# EAGLE design moire_v1.4-bwip (EAGLE 9.2.0)

## Sheet 1 of 2
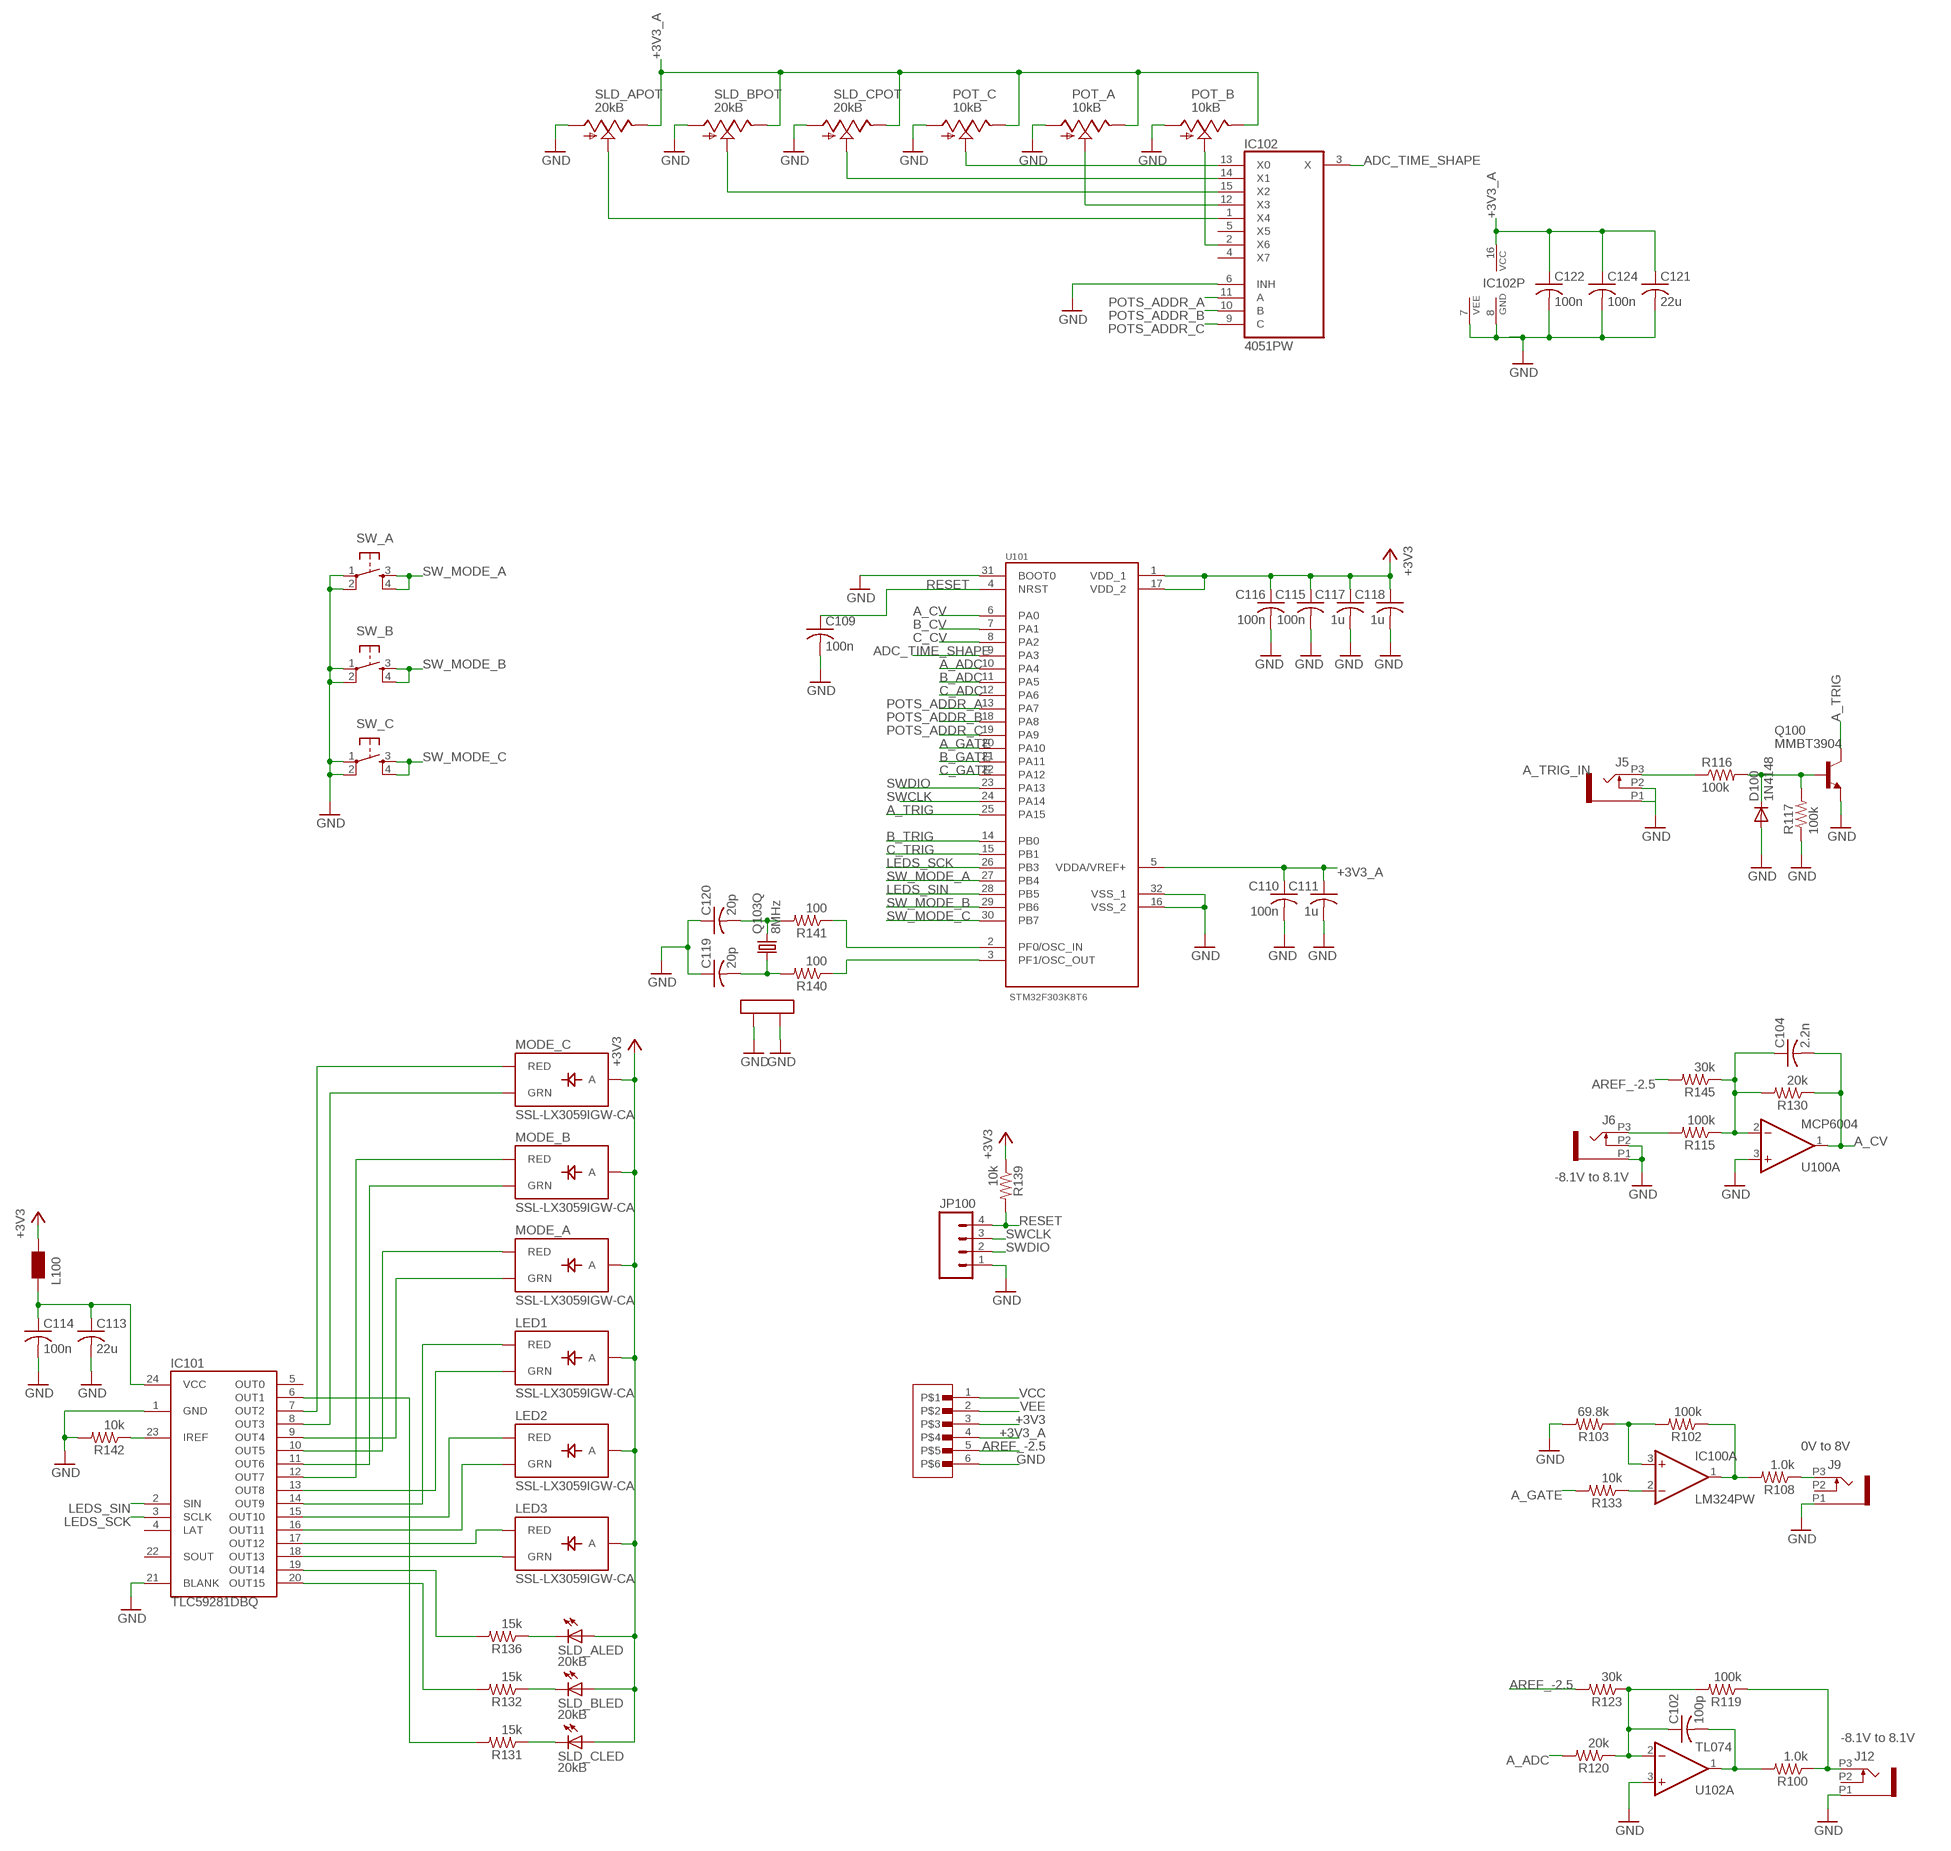
[diagram p0: schematic, sheet 1, part 1 of 2]
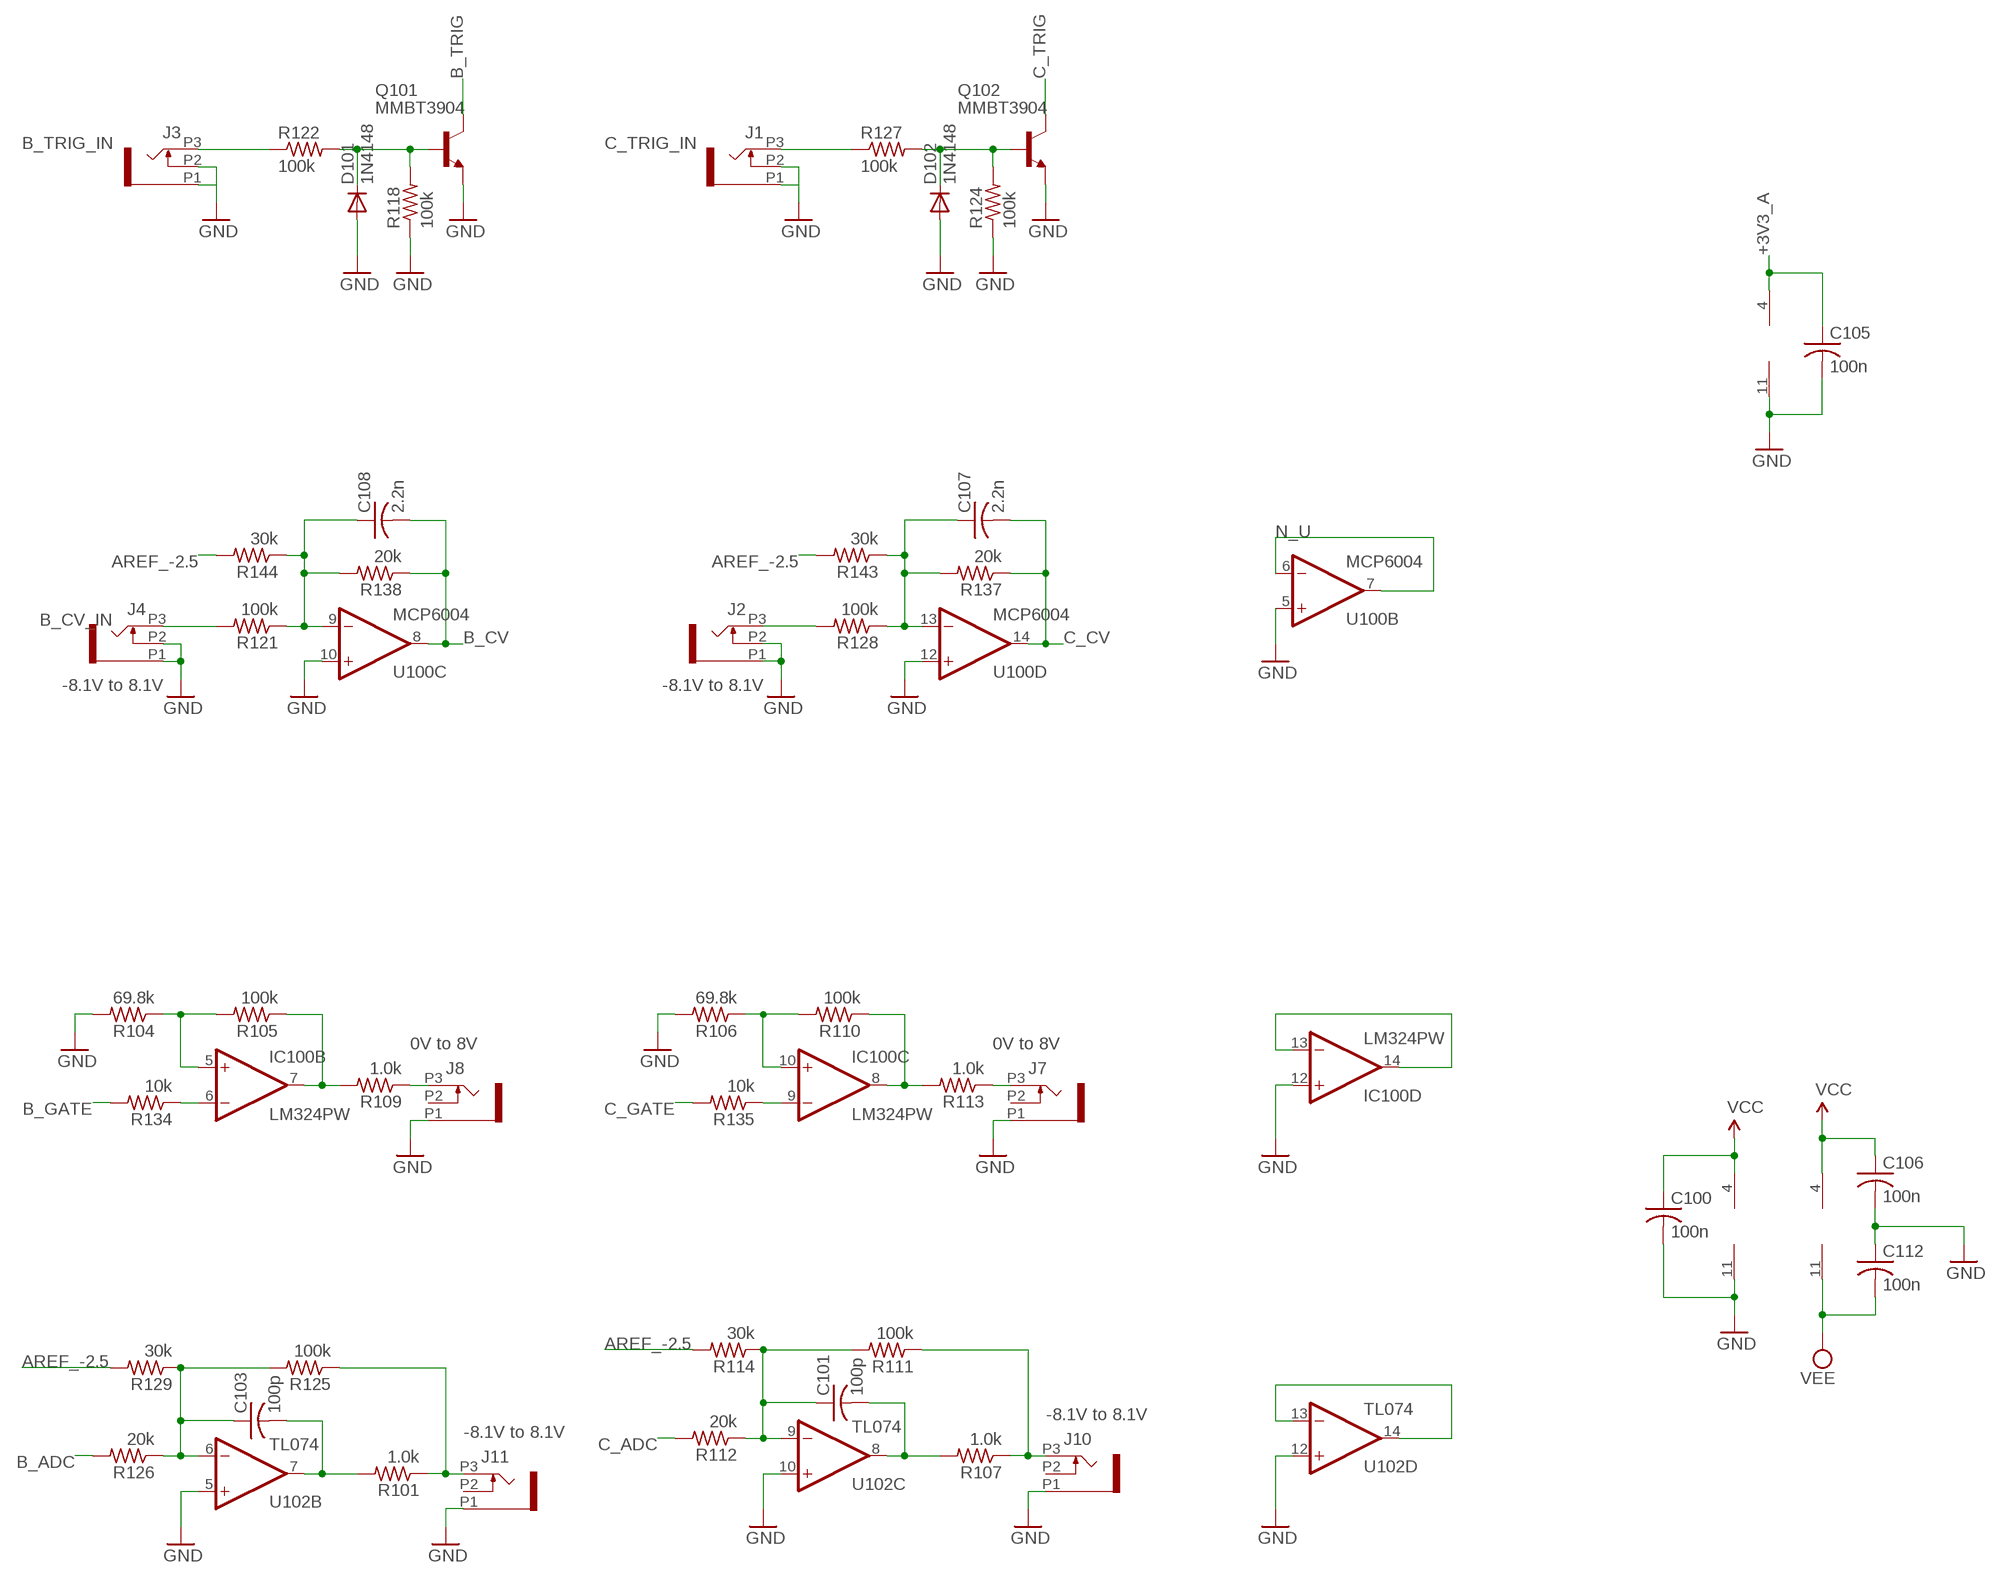
[diagram p1: schematic, sheet 1, part 2 of 2]

### Parts
C100  100n  C-USC0603  [C0603]
C101  100p  C-USC0603  [C0603]
C102  100p  C-USC0603  [C0603]
C103  100p  C-USC0603  [C0603]
C104  2.2n  C-USC0603  [C0603]
C105  100n  C-USC0603  [C0603]
C106  100n  C-USC0603  [C0603]
C107  2.2n  C-USC0603  [C0603]
C108  2.2n  C-USC0603  [C0603]
C109  100n  C-USC0603  [C0603]
C110  100n  C-USC0603  [C0603]
C111  1u  C-USC0603  [C0603]
C112  100n  C-USC0603  [C0603]
C113  22u  C-USC1206  [C1206]
C114  100n  C-USC0603  [C0603]
C115  100n  C-USC0603  [C0603]
C116  100n  C-USC0603  [C0603]
C117  1u  C-USC0603  [C0603]
C118  1u  C-USC0603  [C0603]
C119  20p  C-USC0603  [C0603]
C120  20p  C-USC0603  [C0603]
C121  22u  C-USC1206  [C1206]
C122  100n  C-USC0603  [C0603]
C124  100n  C-USC0603  [C0603]
D100  1N4148  DIODE-SOD523  [SOD523]
D101  1N4148  DIODE-SOD523  [SOD523]
D102  1N4148  DIODE-SOD523  [SOD523]
IC100  LM324PW  TL074PW  [TSSOP14_065]
IC101  TLC59281DBQ  [TSSOP24_0635]
IC102  4051PW  [TSSOP16_065]
J1  PJ301_THONKICONN6  [WQP_PJ_301M6]
J2  PJ301_THONKICONN6  [WQP_PJ_301M6]
J3  PJ301_THONKICONN6  [WQP_PJ_301M6]
J4  PJ301_THONKICONN6  [WQP_PJ_301M6]
J5  PJ301_THONKICONN6  [WQP_PJ_301M6]
J6  PJ301_THONKICONN6  [WQP_PJ_301M6]
J7  PJ301_THONKICONN6  [WQP_PJ_301M6]
J8  PJ301_THONKICONN6  [WQP_PJ_301M6]
J9  PJ301_THONKICONN6  [WQP_PJ_301M6]
J10  PJ301_THONKICONN6  [WQP_PJ_301M6]
J11  PJ301_THONKICONN6  [WQP_PJ_301M6]
J12  PJ301_THONKICONN6  [WQP_PJ_301M6]
JP100  M04PTH  [1X04]
L100  WE-CBF_0603  [0603]
LED1  SSL-LX3059IGW-CA  LED-BICOLOR-THROUGHHOLE-CA  [LED-BICOLOR-THROUGHHOLE-LUMEX]
LED2  SSL-LX3059IGW-CA  LED-BICOLOR-THROUGHHOLE-CA  [LED-BICOLOR-THROUGHHOLE-LUMEX]
LED3  SSL-LX3059IGW-CA  LED-BICOLOR-THROUGHHOLE-CA  [LED-BICOLOR-THROUGHHOLE-LUMEX]
MODE_A  SSL-LX3059IGW-CA  LED-BICOLOR-THROUGHHOLE-CA  [LED-BICOLOR-THROUGHHOLE-LUMEX]
MODE_B  SSL-LX3059IGW-CA  LED-BICOLOR-THROUGHHOLE-CA  [LED-BICOLOR-THROUGHHOLE-LUMEX]
MODE_C  SSL-LX3059IGW-CA  LED-BICOLOR-THROUGHHOLE-CA  [LED-BICOLOR-THROUGHHOLE-LUMEX]
POT_A  10kB  POT_USVERTICAL  [ALPS_POT_VERTICAL]
POT_B  10kB  POT_USVERTICAL  [ALPS_POT_VERTICAL]
POT_C  10kB  POT_USVERTICAL  [ALPS_POT_VERTICAL]
Q100  MMBT3904  MMBT3904LT1-NPN-SOT23-BEC  [SOT23-BEC]
Q101  MMBT3904  MMBT3904LT1-NPN-SOT23-BEC  [SOT23-BEC]
Q102  MMBT3904  MMBT3904LT1-NPN-SOT23-BEC  [SOT23-BEC]
Q103  8MHz  CRYSTAL  [CTS406]
R100  1.0k  R-US_R0603  [R0603]
R101  1.0k  R-US_R0603  [R0603]
R102  100k  R-US_R0603  [R0603]
R103  69.8k  R-US_R0603  [R0603]
R104  69.8k  R-US_R0603  [R0603]
R105  100k  R-US_R0603  [R0603]
R106  69.8k  R-US_R0603  [R0603]
R107  1.0k  R-US_R0603  [R0603]
R108  1.0k  R-US_R0603  [R0603]
R109  1.0k  R-US_R0603  [R0603]
R110  100k  R-US_R0603  [R0603]
R111  100k  R-US_R0603  [R0603]
R112  20k  R-US_R0603  [R0603]
R113  1.0k  R-US_R0603  [R0603]
R114  30k  R-US_R0603  [R0603]
R115  100k  R-US_R0603  [R0603]
R116  100k  R-US_R0603  [R0603]
R117  100k  R-US_R0603  [R0603]
R118  100k  R-US_R0603  [R0603]
R119  100k  R-US_R0603  [R0603]
R120  20k  R-US_R0603  [R0603]
R121  100k  R-US_R0603  [R0603]
R122  100k  R-US_R0603  [R0603]
R123  30k  R-US_R0603  [R0603]
R124  100k  R-US_R0603  [R0603]
R125  100k  R-US_R0603  [R0603]
R126  20k  R-US_R0603  [R0603]
R127  100k  R-US_R0603  [R0603]
R128  100k  R-US_R0603  [R0603]
R129  30k  R-US_R0603  [R0603]
R130  20k  R-US_R0603  [R0603]
R131  15k  R-US_R0603  [R0603]
R132  15k  R-US_R0603  [R0603]
R133  10k  R-US_R0603  [R0603]
R134  10k  R-US_R0603  [R0603]
R135  10k  R-US_R0603  [R0603]
R136  15k  R-US_R0603  [R0603]
R137  20k  R-US_R0603  [R0603]
R138  20k  R-US_R0603  [R0603]
R139  10k  R-US_R0603  [R0603]
R140  100  R-US_R0603  [R0603]
R141  100  R-US_R0603  [R0603]
R142  10k  R-US_R0603  [R0603]
R143  30k  R-US_R0603  [R0603]
R144  30k  R-US_R0603  [R0603]
R145  30k  R-US_R0603  [R0603]
SLD_A  20kB  BOURNS_SLIDER  [BOURNS_SLIDER]
SLD_B  20kB  BOURNS_SLIDER  [BOURNS_SLIDER]
SLD_C  20kB  BOURNS_SLIDER  [BOURNS_SLIDER]
SW_A  TAC_SWITCHPTH  [TACTILE-PTH]
SW_B  TAC_SWITCHPTH  [TACTILE-PTH]
SW_C  TAC_SWITCHPTH  [TACTILE-PTH]
U100  MCP6004  MCP6004_SMD  [SO14]
U101  STM32F303K8T6  [QFP80P900X900X160-32N]
U102  TL074  TL074_SMD  [SO14]
U$1  1X6-SMD-TESTPAD  [6X1-SMD-TESTPAD]

### Nets
+3V3 [power]: C115.1 C116.1 C117.1 C118.1 L100.2 LED1.A LED2.A LED3.A MODE_A.A MODE_B.A MODE_C.A R139.1 SLD_A.B(LED:A) SLD_B.B(LED:A) SLD_C.B(LED:A) U101.1(VDD_1) U101.17(VDD_2) U$1.3 ; also sheet 2
+3V3_A [power]: C105.1 C110.1 C111.1 C121.1 C122.1 C124.1 IC102.16(VCC) POT_A.P$1(E) POT_B.P$1(E) POT_C.P$1(E) SLD_A.3(POT:E) SLD_B.3(POT:E) SLD_C.3(POT:E) U100.4(P:V+) U101.5(VDDA/VREF+) U$1.4 ; also sheet 2
A_ADC: R120.2 U101.10(PA4)
A_CV: C104.2 R130.1 U100.1(A:OUT) U101.6(PA0)
A_GATE: R133.2 U101.20(PA10)
A_TRIG: Q100.C U101.25(PA15)
A_TRIG_IN: J5.P3 R116.1
ADC_TIME_SHAPE: IC102.3(X) U101.9(PA3)
AREF_-2.5: R114.2 R123.2 R129.2 R143.2 R144.2 R145.2 U$1.5 ; also sheet 2
B_ADC: R126.2 U101.11(PA5)
B_CV: C108.2 R138.1 U100.8(C:OUT) U101.7(PA1)
B_CV_IN: J4.P3 R121.2
B_GATE: R134.2 U101.21(PA11)
B_TRIG: Q101.C U101.14(PB0)
B_TRIG_IN: J3.P3 R122.1
C_ADC: R112.2 U101.12(PA6)
C_CV: C107.2 R137.1 U100.14(D:OUT) U101.8(PA2)
C_GATE: R135.2 U101.22(PA12)
C_TRIG: Q102.C U101.15(PB1)
C_TRIG_IN: J1.P3 R127.1
GND: C100.2 C105.2 C106.2 C109.2 C110.2 C111.2 C112.1 C113.2 C114.2 C115.2 C116.2 C117.2 C118.2 C119.1 C120.1 C121.2 C122.2 C124.2 D100.A D101.A D102.A IC100.11(P:V-) IC100.12(D:+IN) IC101.1(GND) IC101.21(BLANK) IC102.6(INH) IC102.7(VEE) IC102.8(GND) J1.P1 J1.P2 J2.P1 J2.P2 J3.P1 J3.P2 J4.P1 J4.P2 J5.P1 J5.P2 J6.P1 J6.P2 J7.P1 J8.P1 J9.P1 J10.P1 J11.P1 J12.P1 JP100.1 POT_A.P$3(A) POT_B.P$3(A) POT_C.P$3(A) Q100.E Q101.E Q102.E Q103.2(LID1) Q103.4(LID2) R103.2 R104.2 R106.2 R117.1 R118.1 R124.1 R142.2 SLD_A.1(POT:A) SLD_B.1(POT:A) SLD_C.1(POT:A) SW_A.1 SW_A.2 SW_B.1 SW_B.2 SW_C.1 SW_C.2 U100.3(A:+IN) U100.5(B:+IN) U100.10(C:+IN) U100.11(P:V-) U100.12(D:+IN) U101.16(VSS_2) U101.31(BOOT0) U101.32(VSS_1) U102.3(A:+IN) U102.5(B:+IN) U102.10(C:+IN) U102.12(D:+IN) U$1.6 ; also sheet 2
LEDS_SCK: IC101.3(SCLK) U101.26(PB3)
LEDS_SIN: IC101.2(SIN) U101.28(PB5)
N$1: R131.1 SLD_C.E(LED:C)
N$2: J9.P3 R108.1
N$6: IC100.13(D:-IN) IC100.14(D:OUT)
N$7: J11.P3 R101.1 R125.1
N$8: C103.1 R125.2 R126.1 R129.1 U102.6(B:-IN)
N$9: R141.1 U101.2(PF0/OSC_IN)
N$10: R140.1 U101.3(PF1/OSC_OUT)
N$11: C120.2 Q103.3 R141.2
N$12: C119.2 Q103.1 R140.2
N$13: J8.P3 R109.1
N$14: U102.13(D:-IN) U102.14(D:OUT)
N$15: C103.2 R101.2 U102.7(B:OUT)
N$16: IC100.1(A:OUT) R102.1 R108.2
N$17: J10.P3 R107.1 R111.1
N$18: C101.1 R111.2 R112.1 R114.1 U102.9(C:-IN)
N$19: C101.2 R107.2 U102.8(C:OUT)
N$20: J7.P3 R113.1
N$21: J2.P3 R128.2
N$22: J6.P3 R115.2
N$24: IC100.3(A:+IN) R102.2 R103.1
N$25: IC100.2(A:-IN) R133.1
N$26: IC100.7(B:OUT) R105.1 R109.2
N$28: IC100.5(B:+IN) R104.1 R105.2
N$29: IC100.6(B:-IN) R134.1
N$30: IC100.8(C:OUT) R110.1 R113.2
N$32: IC101.11(OUT6) MODE_B.GREEN_C(GRN)
N$33: IC101.10(OUT5) MODE_A.RED_C(RED)
N$34: IC101.12(OUT7) MODE_B.RED_C(RED)
N$35: IC101.7(OUT2) MODE_C.RED_C(RED)
N$36: IC101.8(OUT3) MODE_C.GREEN_C(GRN)
N$37: IC101.15(OUT10) LED2.RED_C(RED)
N$38: IC101.16(OUT11) LED2.GREEN_C(GRN)
N$39: IC101.13(OUT8) LED1.GREEN_C(GRN)
N$40: IC101.17(OUT12) LED3.RED_C(RED)
N$41: D102.C Q102.B R124.2 R127.2
N$42: IC101.18(OUT13) LED3.GREEN_C(GRN)
N$43: IC101.14(OUT9) LED1.RED_C(RED)
N$44: C113.1 C114.1 IC101.24(VCC) L100.1
N$45: IC101.19(OUT14) R136.2
N$46: IC101.20(OUT15) R132.2
N$47: IC101.6(OUT1) R131.2
N$48: IC102.1(X4) SLD_A.2(POT:S)
N$49: R132.1 SLD_B.E(LED:C)
N$50: R136.1 SLD_A.E(LED:C)
N$51: IC102.2(X6) POT_B.P$2(S)
N$53: IC102.12(X3) POT_A.P$2(S)
N$54: IC102.13(X0) POT_C.P$2(S)
N$55: IC102.14(X1) SLD_C.2(POT:S)
N$56: IC102.15(X2) SLD_B.2(POT:S)
N$57: C104.1 R115.1 R130.2 R145.1 U100.2(A:-IN)
N$58: C108.1 R121.1 R138.2 R144.1 U100.9(C:-IN)
N$59: C107.1 R128.1 R137.2 R143.1 U100.13(D:-IN)
N$61: IC100.10(C:+IN) R106.1 R110.2
N$62: D101.C Q101.B R118.2 R122.2
N$64: IC100.9(C:-IN) R135.1
N$65: D100.C Q100.B R116.2 R117.2
N$68: IC101.23(IREF) R142.1
N$86: J12.P3 R100.1 R119.1
N$87: C102.1 R119.2 R120.1 R123.1 U102.2(A:-IN)
N$93: C102.2 R100.2 U102.1(A:OUT)
N$101: IC101.9(OUT4) MODE_A.GREEN_C(GRN)
N_U: U100.6(B:-IN) U100.7(B:OUT)
POTS_ADDR_A: IC102.11(A) U101.13(PA7)
POTS_ADDR_B: IC102.10(B) U101.18(PA8)
POTS_ADDR_C: IC102.9(C) U101.19(PA9)
RESET: C109.1 JP100.4 R139.2 U101.4(NRST)
SW_MODE_A: SW_A.3 SW_A.4 U101.27(PB4)
SW_MODE_B: SW_B.3 SW_B.4 U101.29(PB6)
SW_MODE_C: SW_C.3 SW_C.4 U101.30(PB7)
SWCLK: JP100.3 U101.24(PA14)
SWDIO: JP100.2 U101.23(PA13)
VCC: C100.1 C106.1 IC100.4(P:V+) U102.4(P:V+) U$1.1 ; also sheet 2
VEE: C112.2 U102.11(P:V-) U$1.2 ; also sheet 2
Unconnected: IC101.4(LAT) IC101.5(OUT0) IC101.22(SOUT) IC102.4(X7) IC102.5(X5) J7.P2 J8.P2 J9.P2 J10.P2 J11.P2 J12.P2

### Notes on the sheet
- -8.1V to 8.1V | -8.1V to 8.1V | -8.1V to 8.1V
- 0V to 8V | 0V to 8V | 0V to 8V
- -8.1V to 8.1V
- -8.1V to 8.1V | -8.1V to 8.1V

## Sheet 2 of 2
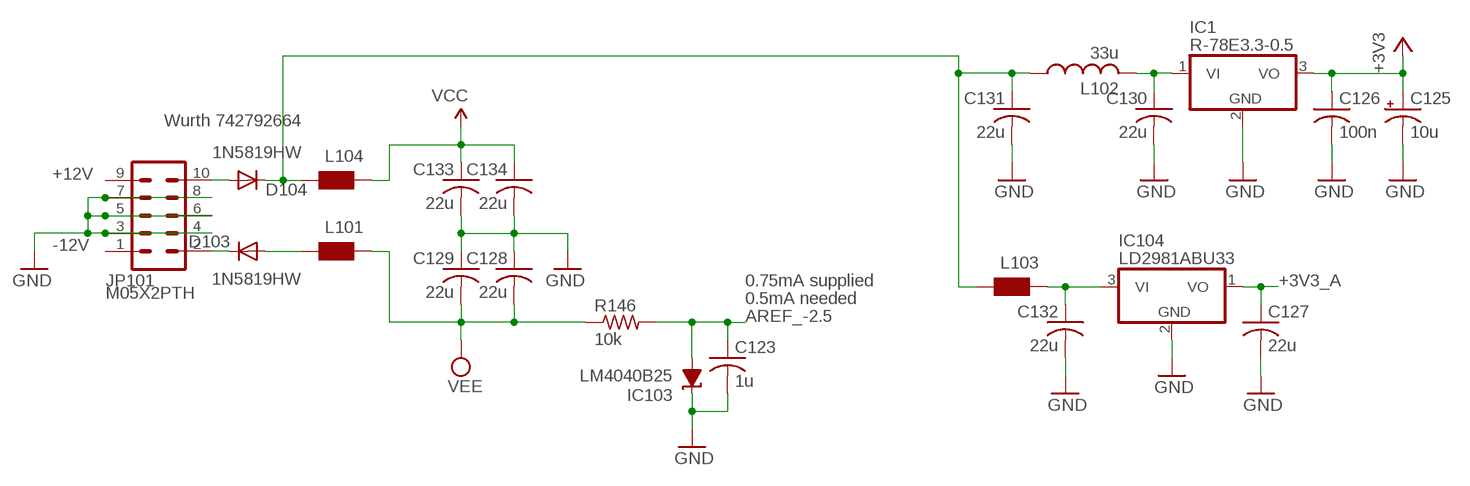
[diagram p2: schematic, sheet 2]

### Parts
C123  1u  C-USC0603  [C0603]
C125  10u  CPOL-USA  [PANASONIC_A]
C126  100n  C-USC0603  [C0603]
C127  22u  C-USC1206  [C1206]
C128  22u  C-USC1206  [C1206]
C129  22u  C-USC1206  [C1206]
C130  22u  C-USC1206  [C1206]
C131  22u  C-USC1206  [C1206]
C132  22u  C-USC1206  [C1206]
C133  22u  C-USC1206  [C1206]
C134  22u  C-USC1206  [C1206]
D103  1N5819HW  DIODE-SOD123  [SOD123]
D104  1N5819HW  DIODE-SOD123  [SOD123]
IC1  R-78E3.3-0.5  WE173950378  [WE78]
IC103  LM4040B25  LM4041B12DBZ  [DBZ_R-PDSO-G3]
IC104  LD2981ABU33  LD2981ABU  [SOT89]
JP101  M05X2PTH  [2X5-PTH]
L101  WE-CBF_0603  [0603]
L102  33u  L-USL2012C  [L2012C]
L103  WE-CBF_0603  [0603]
L104  WE-CBF_0603  [0603]
R146  10k  R-US_R0603  [R0603]

### Nets
+3V3 [power]: C125.+ C126.1 IC1.3(VO) ; also sheet 1
+3V3_A [power]: C127.1 IC104.1(VO) ; also sheet 1
+12V [power]: D104.A JP101.9 JP101.10
-12V [power]: D103.C JP101.1 JP101.2
AREF_-2.5: C123.1 IC103.2(A) R146.2 ; also sheet 1
GND: C123.2 C125.- C126.2 C127.2 C128.1 C129.1 C130.2 C131.2 C132.2 C133.2 C134.2 IC1.2(GND) IC103.1(C) IC104.2(GND) JP101.3 JP101.4 JP101.5 JP101.6 JP101.7 JP101.8 ; also sheet 1
N$3: D103.A L101.2
N$4: C131.1 D104.C L102.1 L103.2 L104.2
N$5: C132.1 IC104.3(VI) L103.1
N$66: C130.1 IC1.1(VI) L102.2
VCC: C133.1 C134.1 L104.1 ; also sheet 1
VEE: C128.2 C129.2 L101.1 R146.1 ; also sheet 1

### Notes on the sheet
- Wurth 742792664
- 0.75mA supplied
- 0.5mA needed

## Library data of the parts
C100-C124 C126-C134 = rcl:C-US: CAPACITOR, American symbol
C125 = rcl:CPOL-US: POLARIZED CAPACITOR, American symbol
D100-D104 = diode:DIODE-: DIODE
IC1 = og-vreg:WE173950378
IC100 = og-linear:TL074: OP AMP
IC101 = og-ics:TLC59281
IC102 = og-ics:4051: 8-channel ANALOG MULTIPLEXER
IC103 = texas:LM4041: PRECISION MICROPOWER SHUNT VOLTAGE REFERENCE Source: http://focus.ti.com/lit/ds/slcs146e/slcs146e.pdf
IC104 = og-vreg:LD2981
J1-J12 = og-pj301_variations:PJ301_THONKICONN
JP100 = SparkFun:M04: Header 4 Standard 4-pin 0.1" header. Use with straight break away headers (SKU : PRT-00116), right angle break away headers (PRT-00553), swiss pins (PRT-00743), machine pins (PRT-00117), and female headers (PRT-00115). Molex polarized connector foot print use with SKU : PRT-08231 with associated crimp pins and housings.
JP101 = og-header:M05X2: Header 5x2 Standard 10-pin dual row 0.1" header. Commonly used with AVR-ISP. Use with Spark Fun Electronics SKU: PRT-00778
L100 L101 L103 L104 = wuerth-elektronik:WE-CBF: SMD EMI Suppression Ferrite Beads - excellent anti-EMI properties - low DCR - impedances till 3000 ohms - rated current up to 6 A
L102 = og-rcl:L-US
LED1-LED3 MODE_A MODE_B MODE_C = og-leds:LED-BICOLOR-THROUGHHOLE-CA
POT_A POT_B POT_C = og-pots:POT_US
Q100-Q102 = transistor:*-NPN-: NPN Transistror BF959 corrected 2008.03.06
Q103 = og-crystal:CRYSTAL: Crystal with 2 extra terminals for the metal LID (Abracon ABMM2 for example)
R100-R146 = rcl:R-US_: RESISTOR, American symbol
SLD_A SLD_B SLD_C = og-pots:BOURNS_SLIDER
SW_A SW_B SW_C = SparkFun:TAC_SWITCH: Momentary Switch Button commonly used for reset or general input. Spark Fun Electronics SKU : COM-00097
U100 = MusicThingModular:MCP6004: Generic Quad Op Amp
U101 = STM32F303K8T6:STM32F303K8T6: Analog and DSP with FPU ARM Cortex-M4 MCU with 64 Kbytes Flash, 72 MHz CPU, CCM, 12-bit ADC 5 MSPS, comparators, op-amp; AVAILABILITY: Unavailable; DESCRIPTION: Analog and DSP with FPU ARM Cortex-M4 MCU with 64 Kbytes Flash, 72 MHz CPU, CCM, 12-bit ADC 5 MSPS, comparators, op-amp; MF: STMicroelectronics; MP: STM32F303K8T6; PACKAGE: LQFP-32 STMicroelectronics; PRICE: None
U102 = MusicThingModular:TL074: Generic Quad Op Amp
U$1 = CUSTOM:1X6-SMD-TESTPAD

## Net classes
1 power: width 0.406 mm

## Board
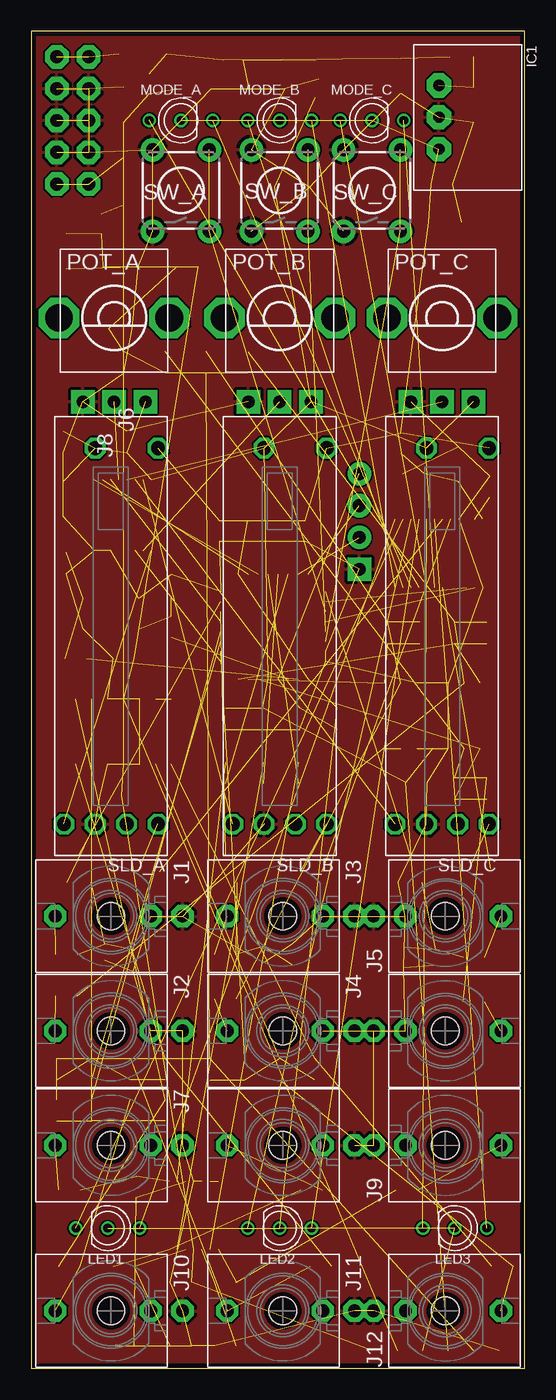
[diagram p3: board, top side]
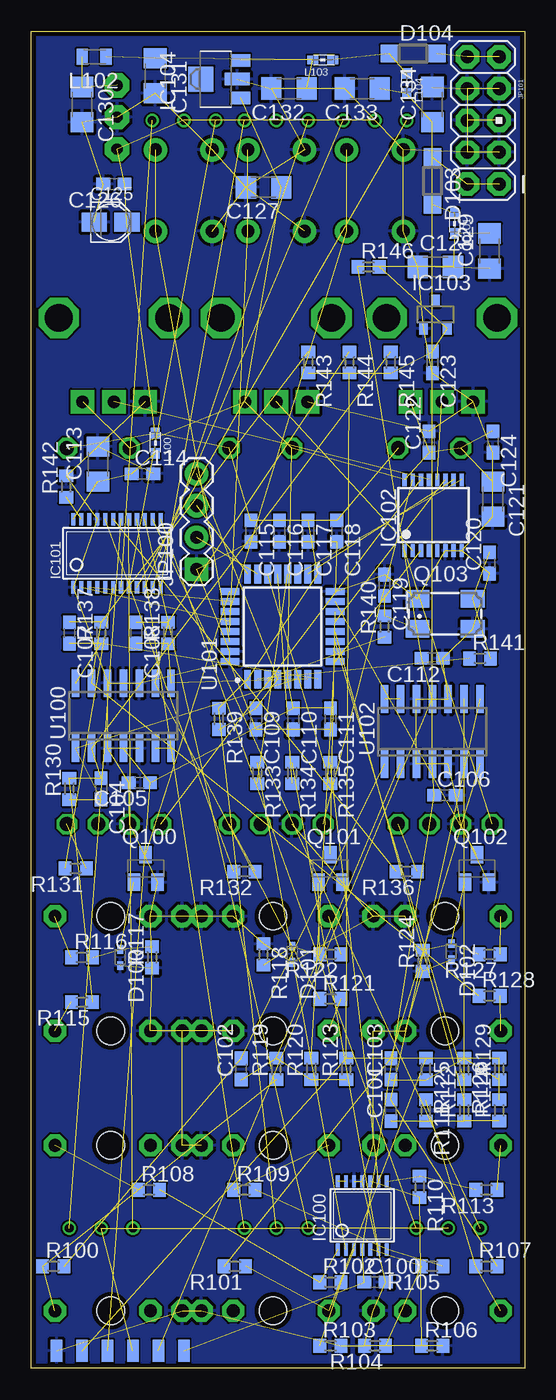
[diagram p4: board, bottom side, seen from below]

Size 39.35 x 106.68 mm. Coordinates in mm from the lower left corner, seen from the top.
Outline: 0,0 39.35,0 39.35,106.68 0,106.68 0,0
Copper layers (1*16): Top 0.035559375mm / dielectric 1.6mm / Bottom 0.035559375mm
Design rules "oshpark-2layer *": minimum track width 6mil, minimum drill 10mil, track to track 6mil, track to pad 6mil, pad to pad 6mil, via to via 6mil, smd to smd 0mil, copper to edge 15mil, drill to drill 6mil, minimum pad ring 5mil, minimum via ring 5mil, stop-mask expansion 2.5mil, vias tented up to drill 0mil, thermal gap 10mil

### Footprints (pad centres in the part's own frame; a part is rotated, then mirrored left to right if it is on the bottom)
C0603 = smd 1.1 x 1: 1 -0.85,0; 2 0.85,0
C1206 = smd 1.6 x 1.8: 1 -1.4,0; 2 1.4,0
PANASONIC_A = smd 2 x 1.5: + 1.3,0; - -1.3,0
SOD523 = smd 0.7 x 0.5: A 0.7,0; C -0.6,0
SOD123 = smd 1.4 x 1.4: A 1.9,0; C -1.9,0
WE78 = drill 0.9 pad 1.93 octagon: 1 -2.54,0; 2 0,0; 3 2.54,0
TSSOP14_065 = smd 0.305 x 0.991: 1 -1.95,-2.718; 2 -1.3,-2.718; 3 -0.65,-2.718; 4 0,-2.718; 5 0.65,-2.718; 6 1.3,-2.718; 7 1.95,-2.718; 8 1.95,2.718; 9 1.3,2.718; 10 0.65,2.718; 11 0,2.718; 12 -0.65,2.718; 13 -1.3,2.718; 14 -1.95,2.718
TSSOP24_0635 = smd 0.33 x 1: 1 -3.493,-2.725; 2 -2.857,-2.725; 3 -2.223,-2.725; 4 -1.587,-2.725; 5 -0.953,-2.725; 6 -0.318,-2.725; 7 0.318,-2.725; 8 0.953,-2.725; 9 1.587,-2.725; 10 2.223,-2.725; 11 2.857,-2.725; 12 3.493,-2.725; 13 3.493,2.725; 14 2.857,2.725; 15 2.223,2.725; 16 1.587,2.725; 17 0.953,2.725; 18 0.318,2.725; 19 -0.318,2.725; 20 -0.953,2.725; 21 -1.587,2.725; 22 -2.223,2.725; 23 -2.857,2.725; 24 -3.493,2.725
TSSOP16_065 = smd 0.35 x 1: 1 -1.95,-2.825; 2 -1.3,-2.825; 3 -0.65,-2.825; 4 0,-2.825; 5 0.65,-2.825; 6 1.3,-2.825; 7 1.95,-2.825; 8 2.6,-2.825; 9 2.6,2.825; 10 1.95,2.825; 11 1.3,2.825; 12 0.65,2.825; 13 0,2.825; 14 -0.65,2.825; 15 -1.3,2.825; 16 -1.95,2.825
DBZ_R-PDSO-G3 = smd 0.7 x 1: 1 -0.95,-1.1; 2 0.95,-1.1; 3 0,1.1
SOT89 = smd 1 x 1.5: 1 -1.499,-1.981; 3 1.499,-1.981 | smd 1 x 2: 2 0,-1.727 | smd 2 x 2: 2@1 0,1.194
WQP_PJ_301M6 = drill 1.016 pad 1.778 octagon: P1 0,-5.715; P2 0,-3.175; P3 0,4.445 | hole 2.2: 0,0
1X04 = drill 1.016 pad 1.88 square: 1 0,0 | drill 1.016 pad 1.88: 2 2.54,0; 3 5.08,0; 4 7.62,0
2X5-PTH = drill 1.016 pad 1.88 octagon: 1 -1.27,5.08; 2 1.27,5.08; 3 -1.27,2.54; 4 1.27,2.54; 5 -1.27,0; 6 1.27,0; 7 -1.27,-2.54; 8 1.27,-2.54; 9 -1.27,-5.08; 10 1.27,-5.08
0603 = smd 0.85 x 0.7: 1 -0.9,0; 2 0.7,0
L2012C = smd 0.9 x 1.25: 1 -0.9,0; 2 1,0
LED-BICOLOR-THROUGHHOLE-LUMEX = drill 0.7: A 0,0; GREEN_C 2.54,0; RED_C -2.54,0
ALPS_POT_VERTICAL = drill 1 pad 1.88 square: P$1 -2.5,6.7; P$2 0,6.7; P$3 2.5,6.7 | drill 2.2 pad 3.175 octagon: P$4 -4.4,0; P$5 4.4,0
SOT23-BEC = smd 1 x 1.4: B -0.95,-1.1; C 0,1.1; E 0.95,-1.1
CTS406 = smd 1.9 x 1.4: 1 -2.2,-1.2; 2 2.2,-1.2; 3 2.2,1.2; 4 -2.2,1.2
R0603 = smd 1 x 1.1: 1 -0.85,0; 2 0.85,0
BOURNS_SLIDER = drill 1.1 octagon: 1 -15,1.25; 2 -15,3.75; 3 15,1.25; B 15,-3.75; DUMMY -15,-1.25; E -15,-3.75
TACTILE-PTH = drill 1.016 pad 1.88: 1 -3.251,2.261; 2 3.251,2.261; 3 -3.251,-2.261; 4 3.251,-2.261
SO14 = smd 0.6 x 2.2: 1 -3.81,-2.6; 2 -2.54,-2.6; 3 -1.27,-2.6; 4 0,-2.6; 5 1.27,-2.6; 6 2.54,-2.6; 7 3.81,-2.6; 8 3.81,2.6; 9 2.54,2.6; 10 1.27,2.6; 11 0,2.6; 12 -1.27,2.6; 13 -2.54,2.6; 14 -3.81,2.6
QFP80P900X900X160-32N = smd 1.5 x 0.55: 1 -4.2,2.8; 2 -4.2,2; 3 -4.2,1.2; 4 -4.2,0.4; 5 -4.2,-0.4; 6 -4.2,-1.2; 7 -4.2,-2; 8 -4.2,-2.8; 17 4.2,-2.8; 18 4.2,-2; 19 4.2,-1.2; 20 4.2,-0.4; 21 4.2,0.4; 22 4.2,1.2; 23 4.2,2; 24 4.2,2.8 | smd 0.55 x 1.5: 9 -2.8,-4.2; 10 -2,-4.2; 11 -1.2,-4.2; 12 -0.4,-4.2; 13 0.4,-4.2; 14 1.2,-4.2; 15 2,-4.2; 16 2.8,-4.2; 25 2.8,4.2; 26 2,4.2; 27 1.2,4.2; 28 0.4,4.2; 29 -0.4,4.2; 30 -1.2,4.2; 31 -2,4.2; 32 -2.8,4.2
6X1-SMD-TESTPAD = smd 0.914 x 1.778: 1 0,0.123; 2 -2.032,0.123; 3 -4.064,0.123; 4 -6.096,0.123; 5 -8.128,0.123; 6 -10.16,0.123

### Placement (x,y rotation side)
C100  11.94,6.86 0 bottom
C101  10.67,20.57 90 bottom
C102  22.61,23.88 90 bottom
C103  10.67,23.88 90 bottom
C104  33.78,46.23 270 bottom
C105  30.73,46.74 180 bottom
C106  6.35,45.72 0 bottom
C107  36.32,58.67 270 bottom
C108  30.99,58.67 270 bottom
C109  21.42,51.82 270 bottom
C110  18.46,51.82 270 bottom
C111  15.49,51.82 270 bottom
C112  7.37,56.64 180 bottom
C113  34.04,72.14 90 bottom
C114  30.48,71.37 0 bottom
C115  21.84,66.8 270 bottom
C116  19.56,66.8 270 bottom
C117  17.27,66.8 270 bottom
C118  14.99,66.8 270 bottom
C119  11.18,62.48 270 bottom
C120  2.79,64.26 90 bottom
C121  2.54,69.34 270 bottom
C122  7.62,73.91 90 bottom
C123  7.37,80.26 270 bottom
C124  2.54,73.91 270 bottom
C125  33.02,91.44 0 bottom
C126  32.77,94.49 180 bottom
C127  20.83,94.23 180 bottom
C128  7.11,87.88 0 bottom
C129  2.79,89.15 90 bottom
C130  35.31,100.84 270 bottom
C131  29.46,103.12 270 bottom
C132  18.8,102.11 180 bottom
C133  12.95,102.11 180 bottom
C134  7.37,100.84 90 bottom
D100  32.26,32.83 270 bottom
D101  18.54,33.07 270 bottom
D102  5.84,33.27 270 bottom
D103  7.37,94.74 270 bottom
D104  8.89,104.9 0 bottom
IC1  32.51,99.82 270 top
IC100  12.95,12.19 0 bottom
IC101  32.51,65.02 0 bottom
IC102  7.62,68.07 0 bottom
IC103  7.11,84.07 0 bottom
IC104  24.64,102.87 90 bottom
J1  6.35,36.07 90 top
J2  6.35,26.92 90 top
J3  20.07,36.07 90 top
J4  20.07,26.92 90 top
J5  33.02,36.07 270 top
J6  33.02,26.92 270 top
J7  6.35,17.78 90 top
J8  20.07,17.78 90 top
J9  33.02,17.78 270 top
J10  6.35,4.57 90 top
J11  20.07,4.57 90 top
J12  33.02,4.57 270 top
JP100  26.16,63.75 90 bottom
JP101  3.3,99.57 180 bottom
L100  29.46,73.91 90 bottom
L101  5.59,91.44 90 bottom
L102  34.29,104.65 180 bottom
L103  16,104.39 0 bottom
L104  9.4,102.62 90 bottom
LED1  6.1,11.18 0 top
LED2  19.81,11.18 0 top
LED3  33.78,11.18 0 top
MODE_A  11.94,99.57 180 top
MODE_B  19.81,99.57 180 top
MODE_C  27.18,99.57 180 top
POT_A  6.6,83.82 180 top
POT_B  19.81,83.82 180 top
POT_C  32.77,83.82 180 top
Q100  30.23,39.88 0 bottom
Q101  15.49,39.88 0 bottom
Q102  3.81,39.88 0 bottom
Q103  6.35,60.2 0 bottom
R100  37.59,8.13 0 bottom
R101  23.11,8.13 180 bottom
R102  15.49,6.86 0 bottom
R103  15.49,1.78 0 bottom
R104  11.94,1.78 180 bottom
R105  7.37,8.13 180 bottom
R106  7.37,1.78 0 bottom
R107  3.05,8.13 0 bottom
R108  29.97,14.22 0 bottom
R109  22.35,14.22 0 bottom
R110  8.38,14.48 270 bottom
R111  7.87,20.57 270 bottom
R112  4.83,20.57 90 bottom
R113  3.05,14.22 180 bottom
R114  2.03,20.57 90 bottom
R115  35.31,29.21 180 bottom
R116  35.31,32.77 0 bottom
R117  29.72,32.77 90 bottom
R118  20.83,33.02 270 bottom
R119  19.81,23.88 90 bottom
R120  17.02,23.88 90 bottom
R121  15.49,29.46 0 bottom
R122  15.49,33.02 180 bottom
R123  14.22,23.88 90 bottom
R124  8.13,32.51 90 bottom
R125  7.87,23.88 270 bottom
R126  4.83,23.88 270 bottom
R127  2.79,33.02 180 bottom
R128  2.79,29.72 0 bottom
R129  2.03,23.88 90 bottom
R130  36.32,46.23 90 bottom
R131  35.81,39.88 180 bottom
R132  22.35,39.62 180 bottom
R133  21.34,47.5 270 bottom
R134  18.54,47.5 270 bottom
R135  15.49,47.5 270 bottom
R136  9.4,39.62 180 bottom
R137  33.78,58.67 90 bottom
R138  28.45,58.67 90 bottom
R139  24.38,51.82 270 bottom
R140  11.18,59.18 90 bottom
R141  3.56,56.64 0 bottom
R142  36.58,70.36 90 bottom
R143  17.27,80.26 270 bottom
R144  13.97,80.26 270 bottom
R145  10.67,80.26 270 bottom
R146  12.45,87.88 0 bottom
SLD_A  6.35,58.42 90 top
SLD_B  19.81,58.42 90 top
SLD_C  32.77,58.42 90 top
SW_A  11.94,93.98 90 top
SW_B  19.81,93.98 90 top
SW_C  27.18,93.98 90 top
U100  32,52.07 0 bottom
U101  19.3,59.18 90 bottom
U102  7.37,50.8 0 bottom
U$1  27.18,1.27 0 bottom

### Tracks (layer width: path | path; a pad name or v marks a point on that pad's centre or on a via)
+3V3  (20 unrouted)
+3V3_A  (17 unrouted)
+12V  (2 unrouted)
-12V  (2 unrouted)
A_ADC  (1 unrouted)
A_CV  (3 unrouted)
A_GATE  (1 unrouted)
A_TRIG  (1 unrouted)
A_TRIG_IN  (1 unrouted)
ADC_TIME_SHAPE  (1 unrouted)
AREF_-2.5  (9 unrouted)
B_ADC  (1 unrouted)
B_CV  (3 unrouted)
B_CV_IN  (1 unrouted)
B_GATE  (1 unrouted)
B_TRIG  (1 unrouted)
B_TRIG_IN  (1 unrouted)
C_ADC  (1 unrouted)
C_CV  (3 unrouted)
C_GATE  (1 unrouted)
C_TRIG  (1 unrouted)
C_TRIG_IN  (1 unrouted)
GND  (103 unrouted)
  pour Bottom: 39.88,106.93 0,106.93 -0.76,106.17 -0.76,-0.25 0,-1.02 39.88,-1.02
  pour Top: 0,-1.78 39.37,-1.78 40.39,-0.76 40.39,107.19 39.62,107.95 -0.25,107.95 -2.03,106.17 -2.03,0.25
LEDS_SCK  (1 unrouted)
LEDS_SIN  (1 unrouted)
N$1  (1 unrouted)
N$2  (1 unrouted)
N$3  (1 unrouted)
N$4  (4 unrouted)
N$5  (2 unrouted)
N$6  (1 unrouted)
N$7  (2 unrouted)
N$8  (4 unrouted)
N$9  (1 unrouted)
N$10  (1 unrouted)
N$11  (2 unrouted)
N$12  (2 unrouted)
N$13  (1 unrouted)
N$14  (1 unrouted)
N$15  (2 unrouted)
N$16  (2 unrouted)
N$17  (2 unrouted)
N$18  (4 unrouted)
N$19  (2 unrouted)
N$20  (1 unrouted)
N$21  (1 unrouted)
N$22  (1 unrouted)
N$24  (2 unrouted)
N$25  (1 unrouted)
N$26  (2 unrouted)
N$28  (2 unrouted)
N$29  (1 unrouted)
N$30  (2 unrouted)
N$32  (1 unrouted)
N$33  (1 unrouted)
N$34  (1 unrouted)
N$35  (1 unrouted)
N$36  (1 unrouted)
N$37  (1 unrouted)
N$38  (1 unrouted)
N$39  (1 unrouted)
N$40  (1 unrouted)
N$41  (3 unrouted)
N$42  (1 unrouted)
N$43  (1 unrouted)
N$44  (3 unrouted)
N$45  (1 unrouted)
N$46  (1 unrouted)
N$47  (1 unrouted)
N$48  (1 unrouted)
N$49  (1 unrouted)
N$50  (1 unrouted)
N$51  (1 unrouted)
N$53  (1 unrouted)
N$54  (1 unrouted)
N$55  (1 unrouted)
N$56  (1 unrouted)
N$57  (4 unrouted)
N$58  (4 unrouted)
N$59  (4 unrouted)
N$61  (2 unrouted)
N$62  (3 unrouted)
N$64  (1 unrouted)
N$65  (3 unrouted)
N$66  (2 unrouted)
N$68  (1 unrouted)
N$86  (2 unrouted)
N$87  (4 unrouted)
N$93  (2 unrouted)
N$101  (1 unrouted)
N_U  (1 unrouted)
POTS_ADDR_A  (1 unrouted)
POTS_ADDR_B  (1 unrouted)
POTS_ADDR_C  (1 unrouted)
RESET  (3 unrouted)
SW_MODE_A  (2 unrouted)
SW_MODE_B  (2 unrouted)
SW_MODE_C  (2 unrouted)
SWCLK  (1 unrouted)
SWDIO  (1 unrouted)
VCC  (7 unrouted)
VEE  (6 unrouted)